# EAGLE design osd_carrier (EAGLE 7.6.0)
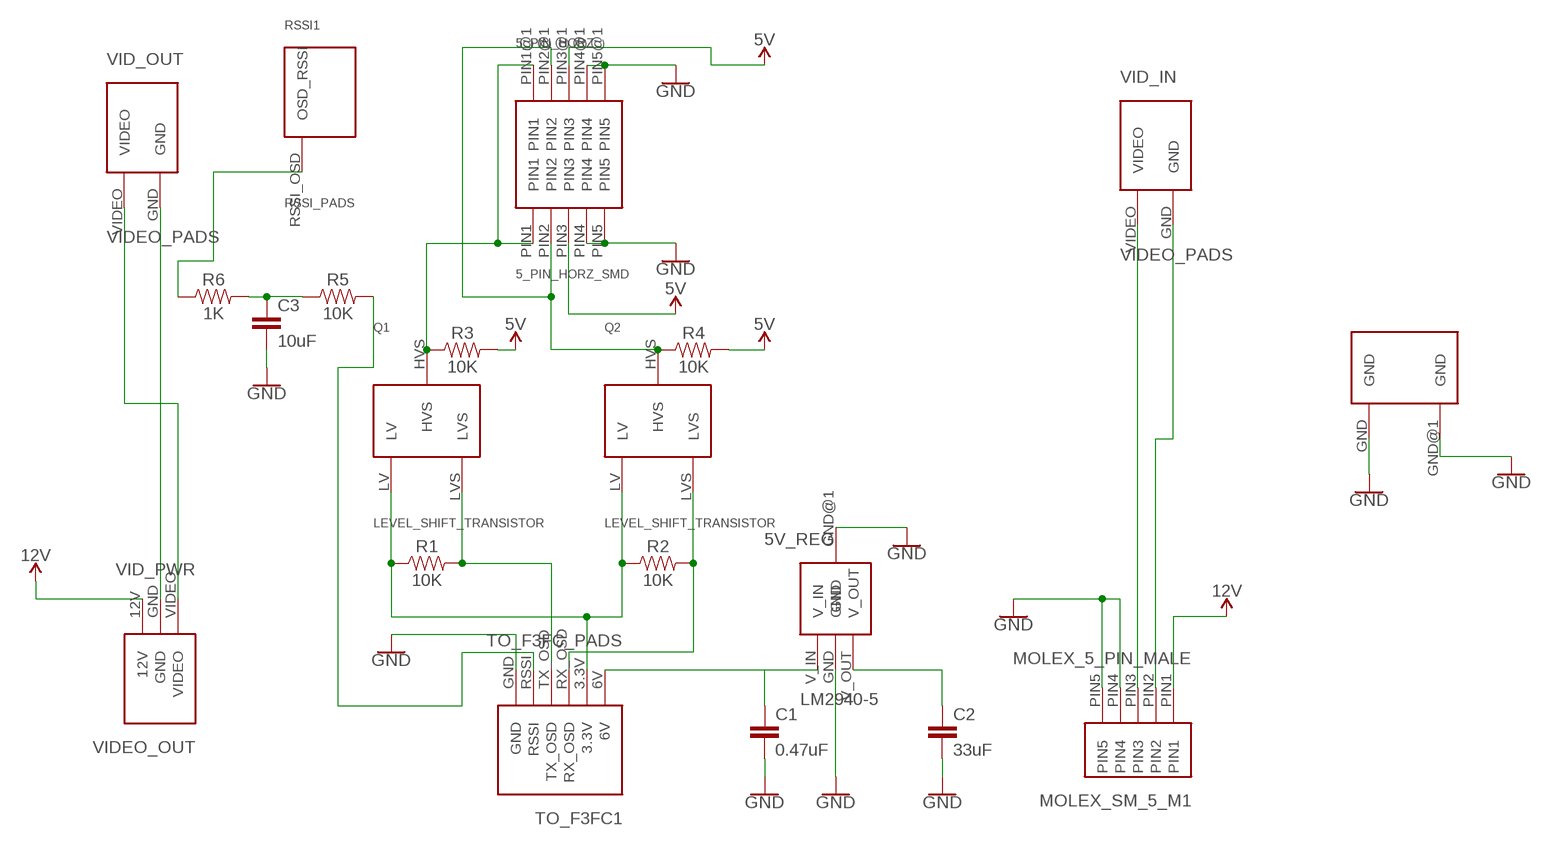
[diagram p0: schematic, sheet 1]

## Parts
5_PIN_HORZ  5_PIN_HORZ_SMD  [5_PIN_HORZ_SMD]
5V_REG  LM2940-5  [LM2940-5]
ANCHOR1  ANCHOR  [ANCHOR]
C1  0.47uF  0.33UF/330NF-0805-50V-10%  [0805]
C2  33uF  0.33UF/330NF-0805-50V-10%  [0805]
C3  10uF  10UF-0805-10V-10%  [0805]
MOLEX_SM_5_M1  MOLEX_5_PIN_MALE  [MOLEX_5_PIN_MALE]
Q1  LEVEL_SHIFT_TRANSISTOR  [LEVEL_SHIFT_TRANSISTOR]
Q2  LEVEL_SHIFT_TRANSISTOR  [LEVEL_SHIFT_TRANSISTOR]
R1  10K  1OHM-0603-1/10W-1%  [0603]
R2  10K  1OHM-0603-1/10W-1%  [0603]
R3  10K  1OHM-0603-1/10W-1%  [0603]
R4  10K  1OHM-0603-1/10W-1%  [0603]
R5  10K  1OHM-0603-1/10W-1%  [0603]
R6  1K  1OHM-0603-1/10W-1%  [0603]
RSSI1  RSSI_PADS  [RSSI_PADS]
TO_F3FC1  TO_F3FC_PADS  [TO_F3FC_PADS]
VID_IN  VIDEO_PADS  [VIDEO_PADS]
VID_OUT  VIDEO_PADS  [VIDEO_PADS]
VIDEO_OUT  VID_PWR  [VID_PWR]

## Nets
3.3V: Q1.LV Q2.LV R1.1 R2.1 TO_F3FC1.3.3V
5V: 5_PIN_HORZ.PIN3 5_PIN_HORZ.PIN3@1(PIN3) 5V_REG.V_OUT C2.1 R3.2 R4.2
6V: 5V_REG.V_IN C1.1 TO_F3FC1.6V
12V: MOLEX_SM_5_M1.PIN1 VIDEO_OUT.12V
D4R_II_RSSI: R5.2 TO_F3FC1.RSSI
GND: 5_PIN_HORZ.PIN4 5_PIN_HORZ.PIN4@1(PIN4) 5_PIN_HORZ.PIN5 5_PIN_HORZ.PIN5@1(PIN5) 5V_REG.GND 5V_REG.GND@1(GND) ANCHOR1.GND ANCHOR1.GND@1(GND) C1.2 C2.2 C3.2 MOLEX_SM_5_M1.PIN2 MOLEX_SM_5_M1.PIN4 MOLEX_SM_5_M1.PIN5 TO_F3FC1.GND VID_IN.GND VID_OUT.GND VIDEO_OUT.GND
N$1: C3.1 R5.1 R6.2
N$2: R6.1 RSSI1.RSSI_OSD(OSD_RSSI)
RX_OSD_HV: 5_PIN_HORZ.PIN2 5_PIN_HORZ.PIN2@1(PIN2) Q2.HVS R4.1
RX_OSD_LV: Q2.LVS R2.2 TO_F3FC1.RX_OSD
TX_OSD_HV: 5_PIN_HORZ.PIN1 5_PIN_HORZ.PIN1@1(PIN1) Q1.HVS R3.1
TX_OSD_LV: Q1.LVS R1.2 TO_F3FC1.TX_OSD
VID_OUT: VID_OUT.VIDEO VIDEO_OUT.VIDEO
VIDEO_IN: MOLEX_SM_5_M1.PIN3 VID_IN.VIDEO

## Library data of the parts
5_PIN_HORZ = jesse_library:5_PIN_HORZ_SMD: Horizontal surface mount 5 pin connector for attaching the minimOSD
5V_REG = jesse_library:LM2940-5: LM2940 5V linea LDO regulator
ANCHOR1 = jesse_library:ANCHOR
C1 C2 = SparkFun-Capacitors:0.33UF/330NF: 0.33µF/330nF ceramic capacitors A capacitor is a passive two-terminal electrical component used to store electrical energy temporarily in an electric field.; PROD_ID: CAP-08469; VALUE: 0.33µF
C3 = SparkFun-Capacitors:10UF: 10.0µF ceramic capacitors A capacitor is a passive two-terminal electrical component used to store electrical energy temporarily in an electric field.; PROD_ID: CAP-11330
MOLEX_SM_5_M1 = jesse_library:MOLEX_5_PIN_MALE: 5 pin male molex recepticle horizontal surface mount
Q1 Q2 = jesse_library:LEVEL_SHIFT_TRANSISTOR: BSS138 Level Shifting Transistor LV is the Low voltage supply (typ. 3.3V) LVS is the low voltage signal (need a 10K resistor between LV and LVS) HVS is the high voltage signal (need a 10K resistor between HVS and HV supply (typ. 5V))
R1-R6 = SparkFun-Resistors:1OHM: 1Ω resistor A resistor is a passive two-terminal electrical component that implements electrical resistance as a circuit element. Resistors act to reduce current flow, and, at the same time, act to lower voltage levels within circuits. - Wikipedia; PROD_ID: RES-08269; VALUE: 1
RSSI1 = jesse_library:RSSI_PADS: pads to hook wires to osd rssi pins
TO_F3FC1 = jesse_library:TO_F3FC_PADS: custom pads to hook F3FC wires to
VID_IN VID_OUT = jesse_library:VIDEO_PADS: surface pads for connecting video signals
VIDEO_OUT = jesse_library:VID_PWR

## Board
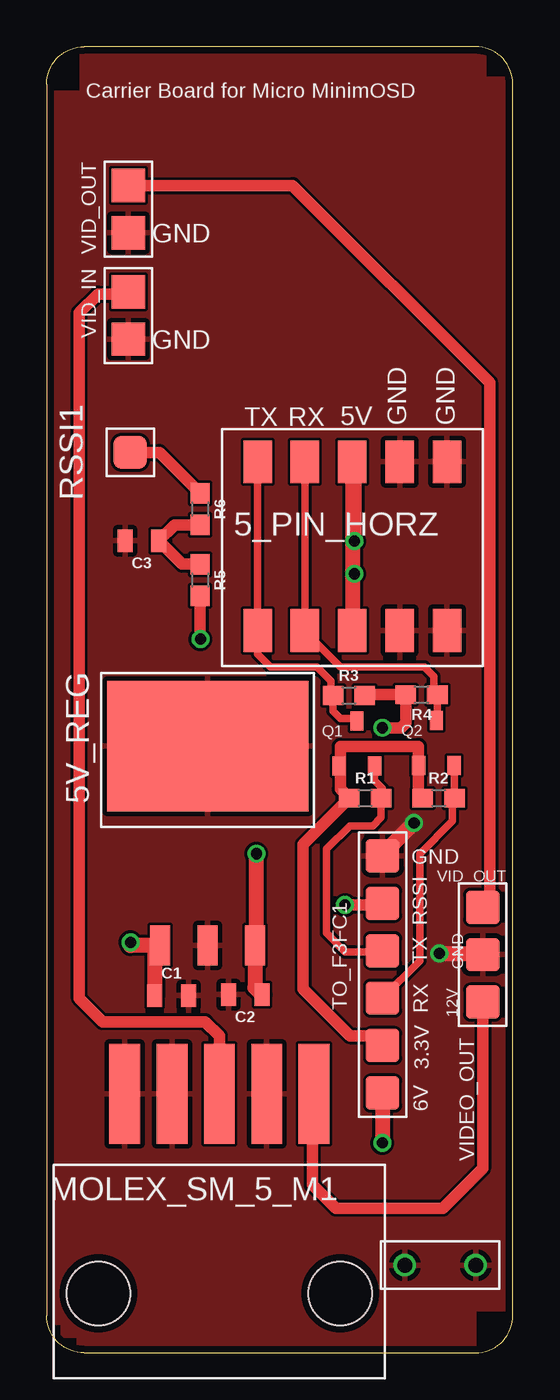
[diagram p1: board, top side]
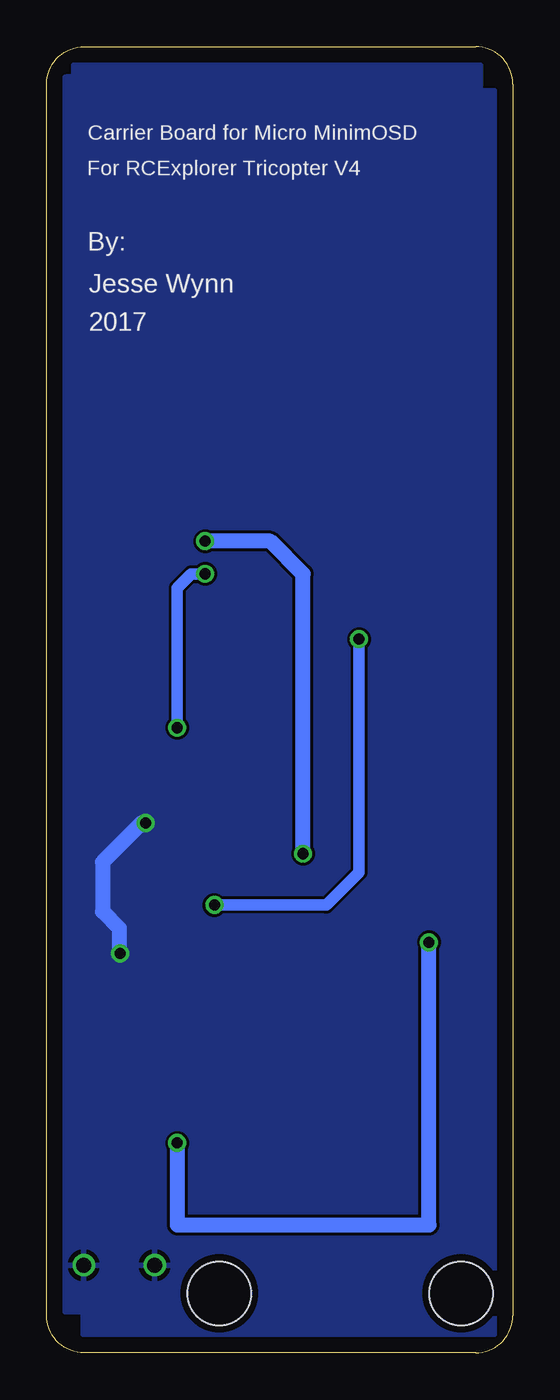
[diagram p2: board, bottom side, seen from below]

Size 25 x 70 mm. Coordinates in mm from the lower left corner, seen from the top.
Outline: 2,0 23,0 arc90 25,2 25,68 arc90 23,70 2,70 arc90 0,68 0,2 arc90 2,0
Copper layers (1*16): Top 0.0356mm / dielectric 1.5011mm / Bottom 0.0356mm
Design rules "LaenPCBOrder": minimum track width 6mil, minimum drill 13mil, track to track 6mil, track to pad 6mil, pad to pad 6mil, via to via 6mil, smd to smd 6mil, copper to edge 15mil, drill to drill 6mil, minimum pad ring 7mil, minimum via ring 7mil, stop-mask expansion 3mil, vias tented up to drill 0mil, thermal gap 10mil

### Footprints (pad centres in the part's own frame; a part is rotated, then mirrored left to right if it is on the bottom)
5_PIN_HORZ_SMD = smd 1.524 x 2.286: PIN1 -5.08,0; PIN1@1 -5.08,9.042; PIN2 -2.54,0; PIN2@1 -2.54,9.042; PIN3 0,0; PIN3@1 0,9.042; PIN4 2.54,0; PIN4@1 2.54,9.042; PIN5 5.08,0; PIN5@1 5.08,9.042
LM2940-5 = smd 1.067 x 2.159: GND 0,0; V_IN -2.54,0; V_OUT 2.54,0 | smd 10.795 x 6.985: GND@1 0,10.681
ANCHOR = drill 0.8: GND 0,0; GND@1 3.81,0
0805 = smd 0.8 x 1.2: 1 -0.9,0; 2 0.9,0
MOLEX_5_PIN_MALE = smd 1.651 x 5.334: PIN1 -5.08,0; PIN2 -2.54,0; PIN3 0,0; PIN4 2.54,0; PIN5 5.08,0 | hole 3.404: -6.477,10.693; 6.477,10.693
LEVEL_SHIFT_TRANSISTOR = smd 0.711 x 1.016: HVS 0.953,2.413; LV 0,0; LVS 1.905,0
0603 = smd 1.1 x 1: 1 -0.85,0; 2 0.85,0
RSSI_PADS = smd 1.778 x 1.778: RSSI_OSD -1.27,0
TO_F3FC_PADS = smd 1.778 x 1.778: 3.3V -5.08,0; 6V -7.62,0; GND 5.08,0; RSSI 2.54,0; RX_OSD -2.54,0; TX_OSD 0,0
VIDEO_PADS = smd 1.778 x 1.778: GND 1.27,0; VIDEO -1.27,0
VID_PWR = smd 1.778 x 1.778: 12V 2.54,0; GND 0,0; VIDEO -2.54,0

### Placement (x,y rotation side)
5_PIN_HORZ  16.39,38.71 0 top
5V_REG  8.63,21.83 0 top
ANCHOR1  19.2,4.7 0 top
C1  6.7,19.15 0 top
C2  10.65,19.2 180 top
C3  5.11,43.52 180 top
MOLEX_SM_5_M1  9.26,13.88 180 top
Q1  15.68,31.44 0 top
Q2  19.94,31.47 0 top
R1  17.08,29.73 0 top
R2  21.02,29.73 0 top
R3  16.21,35.23 0 top
R4  20.1,35.27 180 top
R5  8.23,41.41 270 top
R6  8.23,45.22 270 top
RSSI1  5.75,48.25 0 top
TO_F3FC1  18.01,21.55 90 top
VID_IN  4.38,55.59 270 top
VID_OUT  4.38,61.29 270 top
VIDEO_OUT  23.38,21.34 270 top

### Tracks (layer width: path | path; a pad name or v marks a point on that pad's centre or on a via)
3.3V
  Top 0.406: TO_F3FC1.3.3V 18.01,16.49 18,16.5
  Top 0.61: Q1.LV 15.75,31.44 | 15.75,31.44 15.75,32.5 19.94,32.5 Q2.LV 19.94,29.96 R2.1 | 15.75,31.44 15.75,30.21 R1.1 13.75,27.25 13.75,19.5 16.25,17 17.48,17 TO_F3FC1.3.3V
5V  (via drill 0.6)
  Top 0.61: 5V_REG.V_OUT 11.35,21.83 | R3.2 17.1,35.27 R4.2 19.25,33.75 19,33.5 v18,33.5 | 5_PIN_HORZ.PIN3 16.39,41.64 v16.5,41.75
  Top 0.813: v11.25,26.75 11.25,21.83 5V_REG.V_OUT 11.17,19.58 C2.1 | v16.5,43.5 16.5,47.64 5_PIN_HORZ.PIN3@1 5_PIN_HORZ.PIN3
  Bottom 0.61: v16.5,41.75 17.25,41.75 18,41 v18,33.5
  Bottom 0.813: v11.25,26.75 11.25,41.75 13,43.5 v16.5,43.5
6V  (via drill 0.6)
  Top 0.61: v18.01,11.26 v18,11.25 | 4.5,22.08 v4.5,22 4.5,21.83
  Top 0.813: TO_F3FC1.6V v18.01,11.26 | 4.5,21.83 5V_REG.V_IN 5.8,21.83 C1.1
  Bottom 0.813: v18,11.25 18,6.85 4.5,6.85 v4.5,22
12V
  Top 0.61: 14.63,14 arc45 MOLEX_SM_5_M1.PIN1 14.25,13.79 14.25,9 15.5,7.75 21.25,7.75 23.38,9.88 VIDEO_OUT.12V
D4R_II_RSSI  (via drill 0.6)
  Top 0.61: R5.2 8.23,38.27 v8.25,38.25 | v16,24 17.92,24 TO_F3FC1.RSSI
  Bottom 0.61: v8.25,38.25 8.25,25.75 10,24 v16,24
GND  (via drill 0.6)
  Top 0.61: TO_F3FC1.GND 18.01,26.71 | 23.32,21.4 VIDEO_OUT.GND
  Top 0.813: 18.01,26.71 v19.7,28.4 | v21.05,21.4 23.32,21.4
  Bottom 0.61: v19.7,28.4 19.9,28.4 | 21.1,21.45 v21.05,21.4
  Bottom 0.813: 19.9,28.4 22,26.3 22,23.65 21.1,22.75 21.1,21.45
  pour Top: 1.9,69.65 23.45,69.65 23.45,68.25 24.65,68.25 24.65,2.35 22.9,2.35 22.9,0.35 1.75,0.35 1.75,0.95 0.9,0.95 0.9,1.65 0.45,1.65 0.45,2.2 0.35,2.2 0.35,2.35 0.35,67.5 1.9,67.5
  pour Bottom: 1.75,69 23.55,69 23.55,68.4 23.9,68.4 23.9,68.35 24,68.35 24,2.2 23.05,2.2 23.05,1 1,1 1,67.65 1.75,67.65
N$1
  Top 0.61: R6.2 6.86,44.37 C3.1 7.27,42.26 R5.1
N$2
  Top 0.61: RSSI1.RSSI_OSD 6.05,48.25 R6.1
RX_OSD_HV
  Top 0.406: Q2.HVS 20.95,33.94 R4.1 20.75,35.47 20.75,36.25 20.25,36.75 15.75,36.75 13.85,38.65 5_PIN_HORZ.PIN2 5_PIN_HORZ.PIN2@1
RX_OSD_LV
  Top 0.406: TO_F3FC1.RX_OSD 20,21 20,26.75 21.75,28.5 21.75,29.75 21.77,29.73 R2.2 21.87,31.45 Q2.LVS
TX_OSD_HV
  Top 0.406: Q1.HVS 16.48,34 15.75,34 15.36,34.39 R3.1 15.25,35.34 15.25,36 14.5,36.75 12,36.75 11.31,37.44 5_PIN_HORZ.PIN1 5_PIN_HORZ.PIN1@1
TX_OSD_LV
  Top 0.406: Q1.LVS 17.59,30.66 18,30.25 18,29.8 R1.2 17.93,28.68 17.5,28.25 16.25,28.25 15,27 15,22.5 16,21.5 17.96,21.5 TO_F3FC1.TX_OSD
VID_OUT
  Top 0.61: VID_OUT.VIDEO 13.19,62.56 23.75,52 23.75,24.25 VIDEO_OUT.VIDEO
VIDEO_IN
  Top 0.61: MOLEX_SM_5_M1.PIN3 9.26,16.99 8.5,17.75 3,17.75 1.75,19 1.75,55.75 2.75,56.75 4.27,56.75 VID_IN.VIDEO

### Text on the board
tNames: Carrier Board for Micro MinimOSD | GND | GND | TX | RX | 5V | GND | GND | GND | VID_OUT | RSSI | TX | GND | RX | 12V | 3.3V | 6V
bNames: Carrier Board for Micro MinimOSD | For RCExplorer Tricopter V4 | By: | Jesse Wynn | 2017